# EAGLE design PFC_v1b (EAGLE 7.6.0)
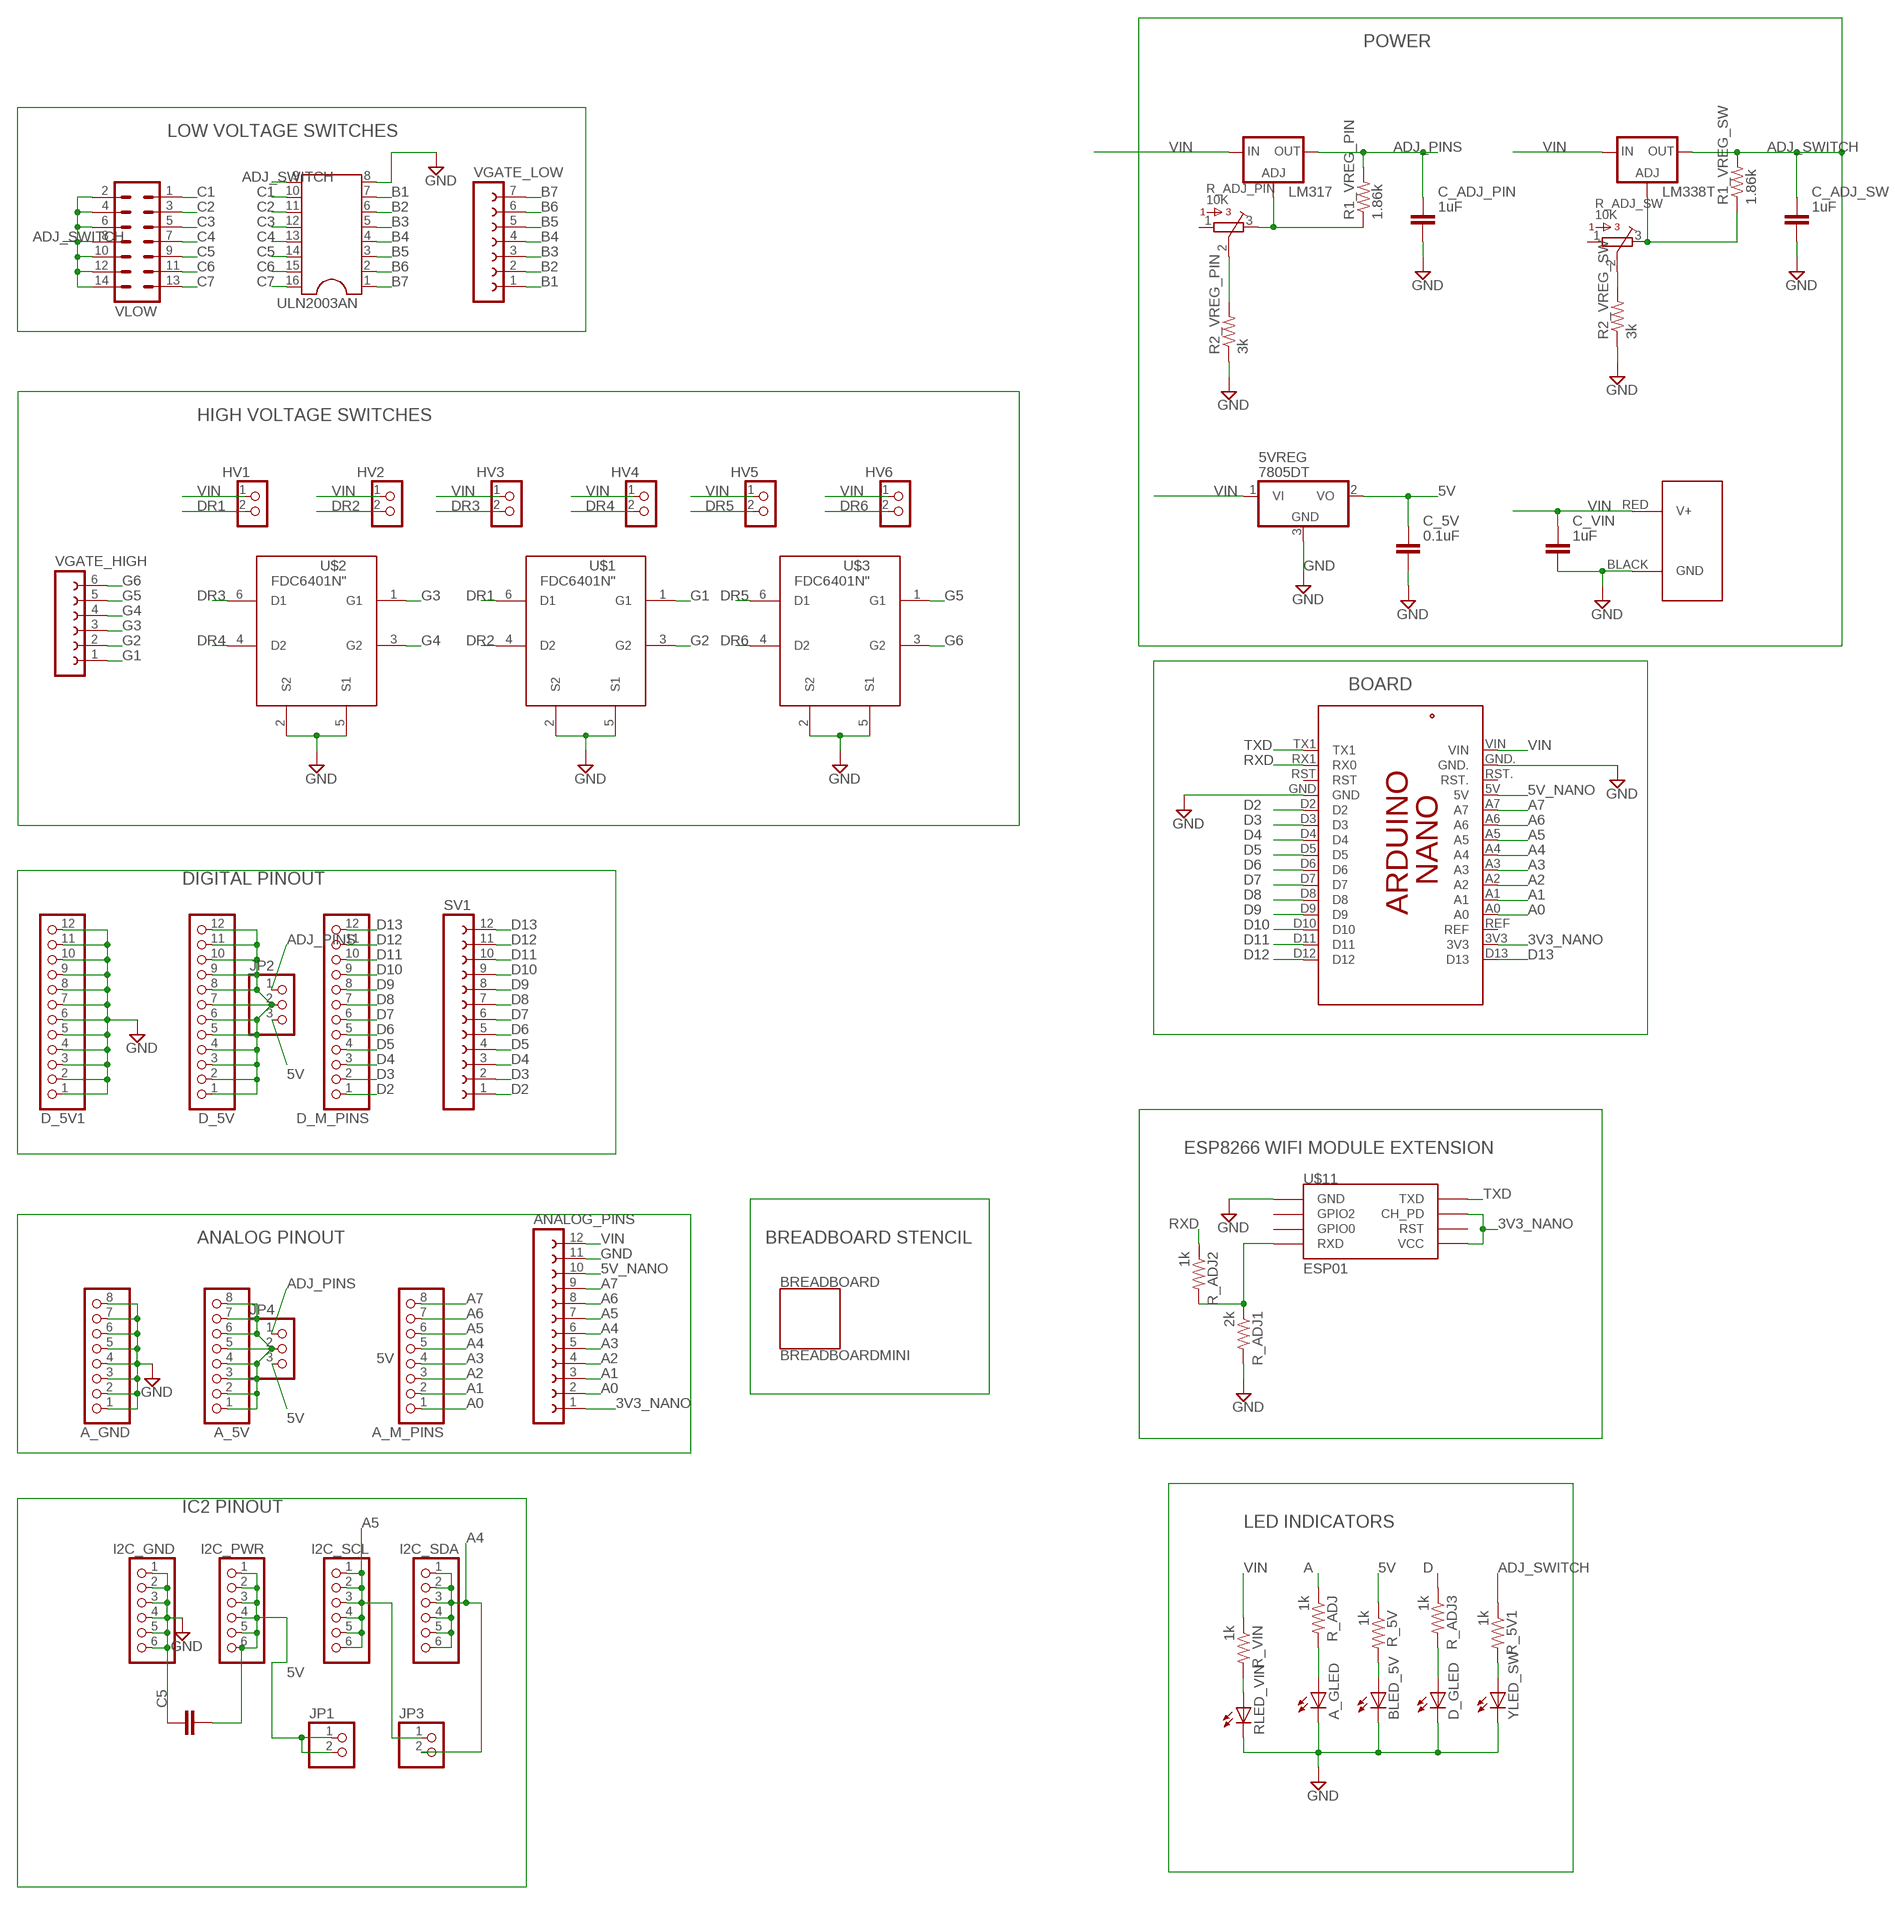
[diagram p0: schematic, sheet 1]

## Parts
5VREG  7805DT  [TO252]
A_5V  PINHD-1X8CLEANBIG  [1X08-CLEANBIG]
A_GLED  LEDCHIP-LED0603  [CHIP-LED0603]
A_GND  PINHD-1X8CLEANBIG  [1X08-CLEANBIG]
A_M_PINS  PINHD-1X8CLEANBIG  [1X08-CLEANBIG]
ANALOG_PINS  FE12-1  [FE12]
BLED_5V  LEDCHIP-LED0603  [CHIP-LED0603]
BREADBOARD  BREADBOARDMINI  [BREADBOARD-MINI]
C5  CAPACITOR_NPOL-0603  [C603]
C_5V  0.1uF  CAPACITOR_NPOL-0603  [C603]
C_ADJ_PIN  1uF  CAPACITOR_NPOL-0603  [C603]
C_ADJ_SW  1uF  CAPACITOR_NPOL-0603  [C603]
C_VIN  1uF  CAPACITOR_NPOL-0603  [C603]
D_5V  PINHD-1X12-CB  [1X12-CB]
D_5V1  PINHD-1X12-CB  [1X12-CB]
D_GLED  LEDCHIP-LED0603  [CHIP-LED0603]
D_M_PINS  PINHD-1X12-CB  [1X12-CB]
HV1  PINHD-2X1  [2X01]
HV2  PINHD-2X1  [2X01]
HV3  PINHD-2X1  [2X01]
HV4  PINHD-2X1  [2X01]
HV5  PINHD-2X1  [2X01]
HV6  PINHD-2X1  [2X01]
I2C_GND  PINHD-1X6CLEAN  [1X06-CLEAN]
I2C_PWR  PINHD-1X6CLEAN  [1X06-CLEAN]
I2C_SCL  PINHD-1X6CLEAN  [1X06-CLEAN]
I2C_SDA  PINHD-1X6CLEAN  [1X06-CLEAN]
J1  POWERPOLE_POWER25A_HORIZONTAL_G2  [POWERPOLE_PAIR_25A_HORIZ_G2]
JP1  HEADER-1X2ROUND  [1X02_ROUND]
JP2  PINHD-1X3CB  [1X03-CLEANBIG]
JP3  HEADER-1X2ROUND  [1X02_ROUND]
JP4  PINHD-1X3CB  [1X03-CLEANBIG]
LM317  LM317TL  [317TL]
LM338T  LM138-TL  [TO220L1]
PCB1  ARDUINO_NANO_SHIELD  [ARDUINO_NANO_SHIELD]
R1_VREG_PIN  1.86k  R-US_R0603  [R0603]
R1_VREG_SW  1.86k  R-US_R0603  [R0603]
R2_VREG_PIN  3k  R-US_R0603  [R0603]
R2_VREG_SW  3k  R-US_R0603  [R0603]
R_5V  1k  R-US_R0603  [R0603]
R_5V1  1k  R-US_R0603  [R0603]
R_ADJ  1k  R-US_R0603  [R0603]
R_ADJ1  2k  R-US_R0603  [R0603]
R_ADJ2  1k  R-US_R0603  [R0603]
R_ADJ3  1k  R-US_R0603  [R0603]
R_ADJ_PIN  10K  3386-P  [3386P]
R_ADJ_SW  10K  3386-P  [3386P]
R_VIN  1k  R-US_R0603  [R0603]
RLED_VIN  LEDCHIP-LED0603  [CHIP-LED0603]
SV1  FE12-1  [FE12]
U$1  FDC6401N"  [SSOT-6]
U$2  FDC6401N"  [SSOT-6]
U$3  FDC6401N"  [SSOT-6]
U$11  ESP01  [ESP01]
ULN2003AN  DIL16S  [SOCKET-16]
VGATE_HIGH  FE06-1  [FE06]
VGATE_LOW  FE07-1  [FE07]
VLOW  MA07-2  [MA07-2]
YLED_SW  LEDCHIP-LED0603  [CHIP-LED0603]

## Nets
3V3_NANO: ANALOG_PINS.1 PCB1.3V3 U$11.CH_PD U$11.VCC
5V: 5VREG.2(VO) C5.2 C_5V.1 I2C_PWR.1 I2C_PWR.2 I2C_PWR.3 I2C_PWR.4 I2C_PWR.5 I2C_PWR.6 JP1.1 JP1.2 JP2.3 JP4.3 R_5V.1
5V_NANO: ANALOG_PINS.10 PCB1.5V
$U: R_ADJ1.1 R_ADJ2.2 U$11.RX(RXD)
A: A_5V.1 A_5V.2 A_5V.3 A_5V.4 A_5V.5 A_5V.6 A_5V.7 A_5V.8 JP4.2 R_ADJ.1
A0: A_M_PINS.1 ANALOG_PINS.2 PCB1.A0
A1: A_M_PINS.2 ANALOG_PINS.3 PCB1.A1
A2: A_M_PINS.3 ANALOG_PINS.4 PCB1.A2
A3: A_M_PINS.4 ANALOG_PINS.5 PCB1.A3
A4: A_M_PINS.5 ANALOG_PINS.6 I2C_SDA.1 I2C_SDA.2 I2C_SDA.3 I2C_SDA.4 I2C_SDA.5 I2C_SDA.6 JP3.2 PCB1.A4
A5: A_M_PINS.6 ANALOG_PINS.7 I2C_SCL.1 I2C_SCL.2 I2C_SCL.3 I2C_SCL.4 I2C_SCL.5 I2C_SCL.6 JP3.1 PCB1.A5
A6: A_M_PINS.7 ANALOG_PINS.8 PCB1.A6
A7: A_M_PINS.8 ANALOG_PINS.9 PCB1.A7
ADJ_PINS: C_ADJ_PIN.1 JP2.1 JP4.1 LM317.2(OUT) R1_VREG_PIN.2
ADJ_SWITCH: C_ADJ_SW.1 LM338T.2(OUT) R1_VREG_SW.2 R_5V1.1 ULN2003AN.9 VLOW.2 VLOW.4 VLOW.6 VLOW.8 VLOW.10 VLOW.12 VLOW.14
B1: ULN2003AN.7 VGATE_LOW.1
B2: ULN2003AN.6 VGATE_LOW.2
B3: ULN2003AN.5 VGATE_LOW.3
B4: ULN2003AN.4 VGATE_LOW.4
B5: ULN2003AN.3 VGATE_LOW.5
B6: ULN2003AN.2 VGATE_LOW.6
B7: ULN2003AN.1 VGATE_LOW.7
C1: ULN2003AN.10 VLOW.1
C2: ULN2003AN.11 VLOW.3
C3: ULN2003AN.12 VLOW.5
C4: ULN2003AN.13 VLOW.7
C5: ULN2003AN.14 VLOW.9
C6: ULN2003AN.15 VLOW.11
C7: ULN2003AN.16 VLOW.13
D: D_5V.1 D_5V.2 D_5V.3 D_5V.4 D_5V.5 D_5V.6 D_5V.7 D_5V.8 D_5V.9 D_5V.10 D_5V.11 D_5V.12 JP2.2 R_ADJ3.1
D2: D_M_PINS.1 PCB1.D2 SV1.1
D3: D_M_PINS.2 PCB1.D3 SV1.2
D4: D_M_PINS.3 PCB1.D4 SV1.3
D5: D_M_PINS.4 PCB1.D5 SV1.4
D6: D_M_PINS.5 PCB1.D6 SV1.5
D7: D_M_PINS.6 PCB1.D7 SV1.6
D8: D_M_PINS.7 PCB1.D8 SV1.7
D9: D_M_PINS.8 PCB1.D9 SV1.8
D10: D_M_PINS.9 PCB1.D10 SV1.9
D11: D_M_PINS.10 PCB1.D11 SV1.10
D12: D_M_PINS.11 PCB1.D12 SV1.11
D13: D_M_PINS.12 PCB1.D13 SV1.12
DR1: HV1.2 U$1.6(D1)
DR2: HV2.2 U$1.4(D2)
DR3: HV3.2 U$2.6(D1)
DR4: HV4.2 U$2.4(D2)
DR5: HV5.2 U$3.6(D1)
DR6: HV6.2 U$3.4(D2)
G1: U$1.1(G1) VGATE_HIGH.1
G2: U$1.3(G2) VGATE_HIGH.2
G3: U$2.1(G1) VGATE_HIGH.3
G4: U$2.3(G2) VGATE_HIGH.4
G5: U$3.1(G1) VGATE_HIGH.5
G6: U$3.3(G2) VGATE_HIGH.6
GND: 5VREG.3(GND) A_GLED.C A_GND.1 A_GND.2 A_GND.3 A_GND.4 A_GND.5 A_GND.6 A_GND.7 A_GND.8 ANALOG_PINS.11 BLED_5V.C C5.1 C_5V.2 C_ADJ_PIN.2 C_ADJ_SW.2 C_VIN.2 D_5V1.1 D_5V1.2 D_5V1.3 D_5V1.4 D_5V1.5 D_5V1.6 D_5V1.7 D_5V1.8 D_5V1.9 D_5V1.10 D_5V1.11 D_5V1.12 D_GLED.C I2C_GND.1 I2C_GND.2 I2C_GND.3 I2C_GND.4 I2C_GND.5 I2C_GND.6 J1.BLACK(GND) PCB1.GND PCB1.GND. R2_VREG_PIN.1 R2_VREG_SW.1 R_ADJ1.2 RLED_VIN.C U$1.2(S2) U$1.5(S1) U$2.2(S2) U$2.5(S1) U$3.2(S2) U$3.5(S1) U$11.GND ULN2003AN.8 YLED_SW.C
N$1: R_VIN.2 RLED_VIN.A
N$2: R2_VREG_SW.2 R_ADJ_SW.2
N$3: A_GLED.A R_ADJ.2
N$4: BLED_5V.A R_5V.2
N$5: LM338T.1(ADJ) R1_VREG_SW.1 R_ADJ_SW.3
N$15: D_GLED.A R_ADJ3.2
N$21: R_5V1.2 YLED_SW.A
N$23: LM317.1(ADJ) R1_VREG_PIN.1 R_ADJ_PIN.3
N$24: R2_VREG_PIN.2 R_ADJ_PIN.2
RXD: PCB1.RX1(RX0) R_ADJ2.1
TXD: PCB1.TX1 U$11.TX(TXD)
VIN: 5VREG.1(VI) ANALOG_PINS.12 C_VIN.1 HV1.1 HV2.1 HV3.1 HV4.1 HV5.1 HV6.1 J1.RED(V+) LM317.3(IN) LM338T.3(IN) PCB1.VIN R_VIN.1
Unconnected: PCB1.REF PCB1.RST PCB1.RST. R_ADJ_PIN.1 R_ADJ_SW.1 U$11.GPIO0 U$11.GPIO2 U$11.RST

## Notes on the sheet
- POWER
- LOW VOLTAGE SWITCHES
- HIGH VOLTAGE SWITCHES
- BOARD
- DIGITAL PINOUT
- ESP8266 WIFI MODULE EXTENSION
- ANALOG PINOUT | BREADBOARD STENCIL
- IC2 PINOUT
- LED INDICATORS

## Library data of the parts
5VREG = adafruit:78*: Positive VOLTAGE REGULATOR Added bigger pads to the TO-92 package
A_5V A_GND A_M_PINS = adafruit:PINHD-1X8: PIN HEADER
A_GLED BLED_5V D_GLED RLED_VIN YLED_SW = led:LED: LED OSRAM: - CHIPLED LG R971, LG N971, LY N971, LG Q971, LY Q971, LO R971, LY R971 LH N974, LH R974 LS Q976, LO Q976, LY Q976 LO Q996 - Hyper CHIPLED LW Q18S LB Q993, LB Q99A, LB R99A - SideLED LS A670, LO A670, LY A670, LG A670, LP A670 LB A673, LV A673, LT A673, LW A673 LH A674 LY A675 LS A676, LA A676, LO A676, LY A676, LW A676 LS A679, LY A679, LG A679 - Hyper Micro SIDELED® LS Y876, LA Y876, LO Y876, LY Y876 LT Y87S - SmartLED LW L88C, LW L88S LB L89C, LB L89S, LG L890 LS L89K, LO L89K, LY L89K LS L896, LA L896, LO L896, LY L896 - TOPLED LS T670, LO T670, LY T670, LG T670, LP T670 LSG T670, LSP T670, LSY T670, LOP T670, LYG T670 LG T671, LOG T671, LSG T671 LB T673, LV T673, LT T673, LW T673 LH T674 LS T676, LA T676, LO T676, LY T676, LB T676, LH T676, LSB T676, LW T676 LB T67C, LV T67C, LT T67C, LS T67K, LO T67K, LY T67K, LW E67C LS E67B, LA E67B, LO E67B, LY E67B, LB E67C, LV E67C, LT E67C LW T67C LS T679, LY T679, LG T679 LS T770, LO T770, LY T770, LG T770, LP T770 LB T773, LV T773, LT T773, LW T773 LH T774 LS E675, LA E675, LY E675, LS T675 LS T776, LA T776, LO T776, LY T776, LB T776 LHGB T686 LT T68C, LB T68C - Hyper Mini TOPLED® LB M676 - Mini TOPLED Santana® LG M470 LS M47K, LO M47K, LY M47K Source: http://www.osram.convergy.de LUXEON: - LUMILED® LXK2-PW12-R00, LXK2-PW12-S00, LXK2-PW14-U00, LXK2-PW14-V00 LXK2-PM12-R00, LXK2-PM12-S00, LXK2-PM14-U00 LXK2-PE12-Q00, LXK2-PE12-R00, LXK2-PE12-S00, LXK2-PE14-T00, LXK2-PE14-U00 LXK2-PB12-K00, LXK2-PB12-L00, LXK2-PB12-M00, LXK2-PB14-N00, LXK2-PB14-P00, LXK2-PB14-Q00 LXK2-PR12-L00, LXK2-PR12-M00, LXK2-PR14-Q00, LXK2-PR14-R00 LXK2-PD12-Q00, LXK2-PD12-R00, LXK2-PD12-S00 LXK2-PH12-R00, LXK2-PH12-S00 LXK2-PL12-P00, LXK2-PL12-Q00, LXK2-PL12-R00 Source: www.luxeon.com KINGBRIGHT: KA-3528ASYC Source: www.kingbright.com
ANALOG_PINS SV1 = con-lsta:FE12-1: FEMALE HEADER; OC_FARNELL: unknown; OC_NEWARK: unknown
BREADBOARD = SparkFun-Boards:BREADBOARD: SparkFun Breadboard Mini This is the mechnical outline for the very small self adhesive breadboard from SparkFun Electronics and our prototyping breadboard of the same size. Good for very small proto areas. SparkFun Products: White <https://www.sparkfun.com/products/7916> Green <https://www.sparkfun.com/products/12046> Black <https://www.sparkfun.com/products/12047> Red <https://www.sparkfun.com/products/12044> Blue <https://www.sparkfun.com/products/12045> SparkFun Solder-able Breadboard-Mini <https://www.sparkfun.com/products/12702>; PROD_ID: COMP-12034
C5 C_5V C_ADJ_PIN C_ADJ_SW C_VIN = dp_devices:CAPACITOR_NPOL: Non-Polarized capacitor in various packages
D_5V D_5V1 D_M_PINS = adafruit:PINHD-1X12: PIN HEADER
HV1-HV6 = pinhead:PINHD-2X1
I2C_GND I2C_PWR I2C_SCL I2C_SDA = adafruit:PINHD-1X6: PIN HEADER
J1 = powerpoles:POWERPOLE_POWER: Anderson Powerpole Power Connector using ameteur radio standard layout
JP1 JP3 = microbuilder:HEADER-1X2: PIN HEADER
JP2 JP4 = adafruit:PINHD-1X3: PIN HEADER
LM317 = v-reg:LM317TL: VOLTAGE REGULATOR
LM338T = v-reg:LM138-TL: VOLTAGE REGULATOR
PCB1 = E14_Arduino_revC:ARDUINO_NANO_SHIELD: Arduino Nano pinout for making a shield
R1_VREG_PIN R1_VREG_SW R2_VREG_PIN R2_VREG_SW R_5V R_5V1 R_ADJ R_ADJ1-R_ADJ3 R_VIN = resistor:R-US_: RESISTOR, American symbol
R_ADJ_PIN R_ADJ_SW = bourns:3386-: 3386 Series 3/8" Square Trimmer
U$1-U$3 = fairchild:FDC6401N: Dual N Channel MOSFET
U$11 = esp8266modules:ESP01: ESP8266 Wifi module 01
ULN2003AN = ic-package:DIL16: Dual In Line / Socket
VGATE_HIGH = con-lsta:FE06-1: FEMALE HEADER; OC_FARNELL: unknown; OC_NEWARK: unknown
VGATE_LOW = con-lsta:FE07-1: FEMALE HEADER; OC_FARNELL: unknown; OC_NEWARK: unknown
VLOW = con-lstb:MA07-2: PIN HEADER; OC_FARNELL: unknown; OC_NEWARK: unknown

## Board
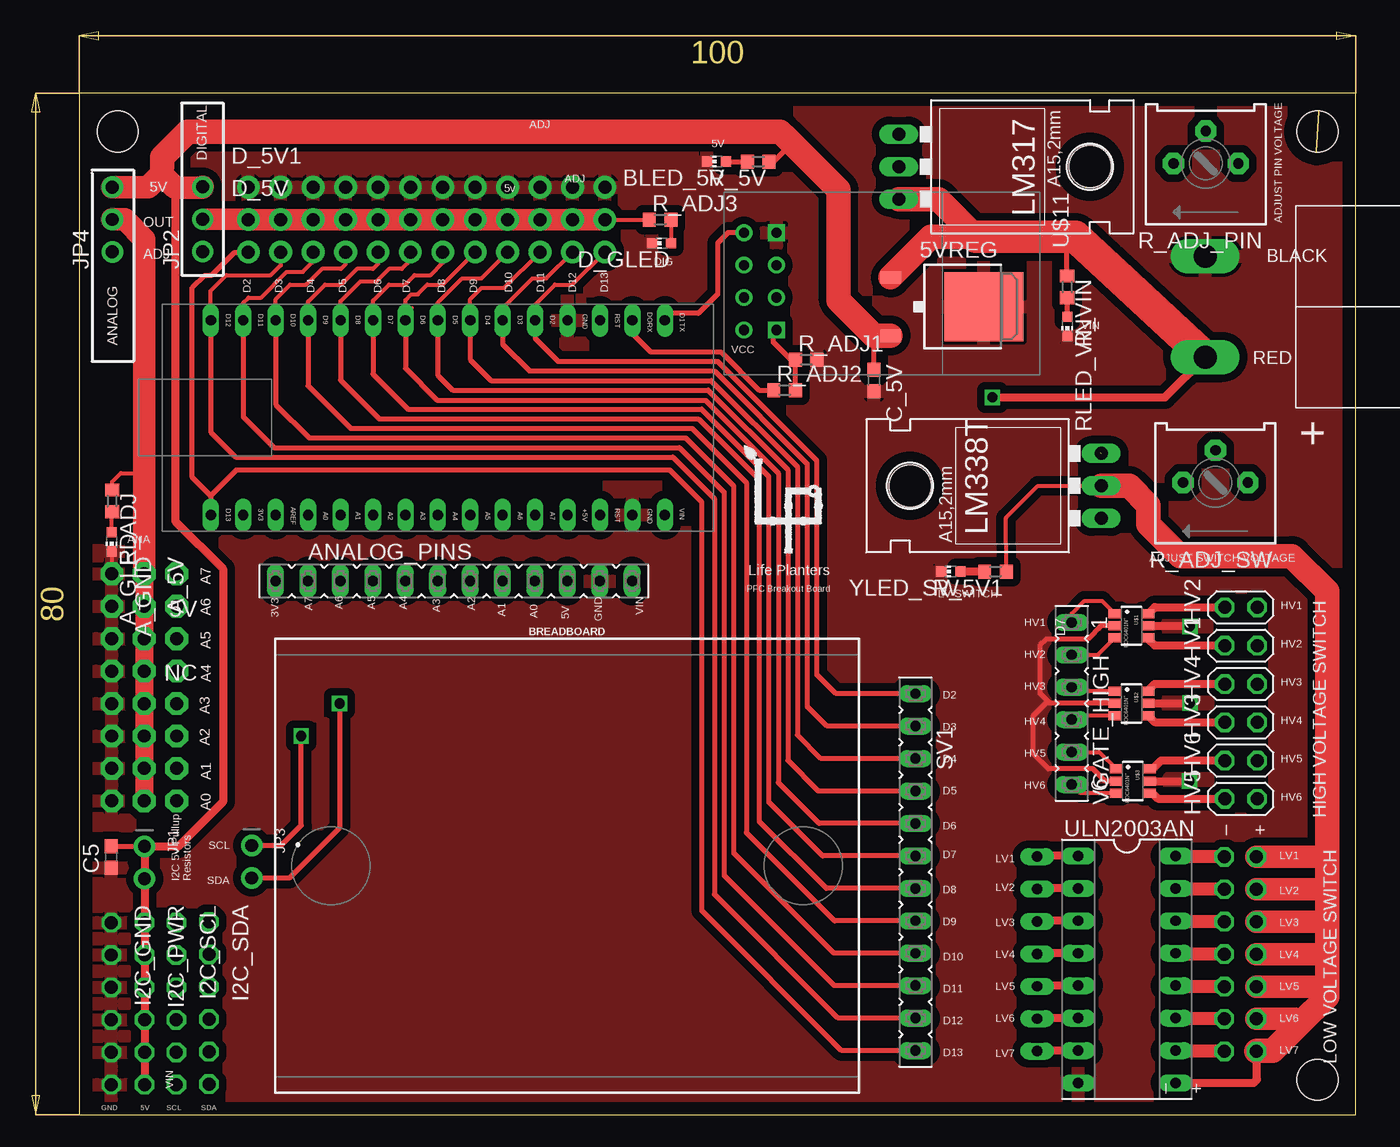
[diagram p1: board, top side]
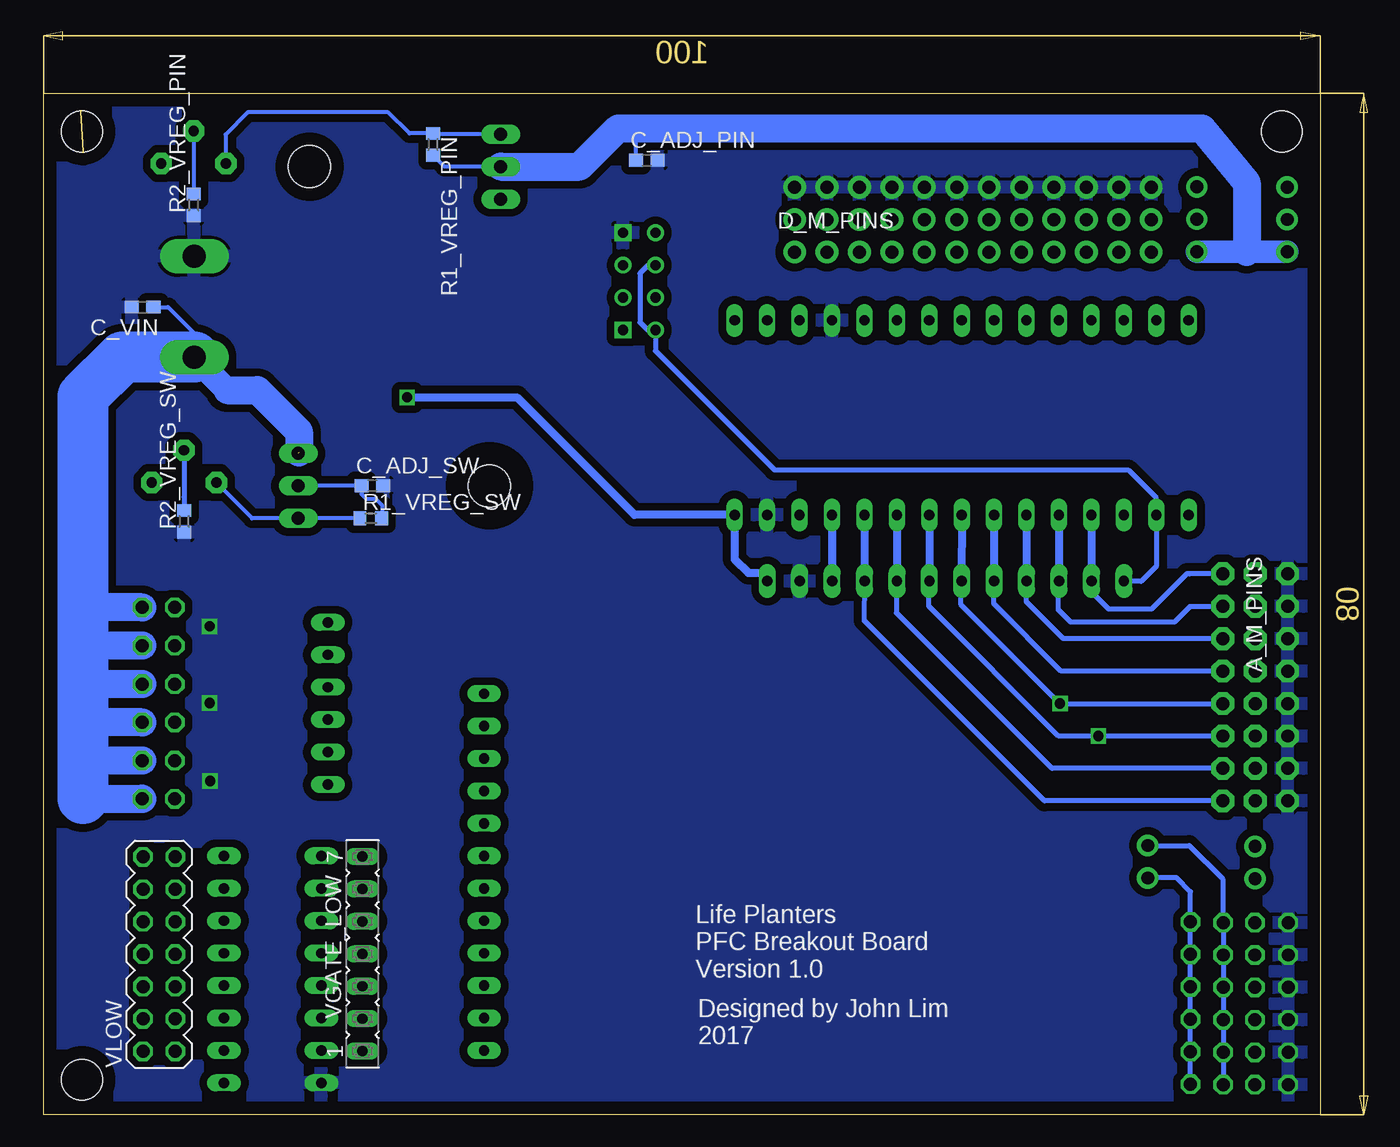
[diagram p2: board, bottom side, seen from below]

Size 100 x 80 mm. Coordinates in mm from the lower left corner, seen from the top.
Outline: 0,0 100,0 100,80 0,80 0,0
Copper layers (1*16): Top 0.035mm / dielectric 1.5mm / Bottom 0.035mm
Design rules "default": minimum track width 10mil, minimum drill 24mil, track to track 8mil, track to pad 8mil, pad to pad 8mil, via to via 8mil, smd to smd 8mil, copper to edge 40mil, drill to drill 8mil, minimum pad ring 10mil, minimum via ring 8mil, stop-mask expansion 4mil, vias tented up to drill 0mil, thermal gap 10mil
Holes 3.2 mm at 97,77 97,2.75 3,77

### Footprints (pad centres in the part's own frame; a part is rotated, then mirrored left to right if it is on the bottom)
TO252 = smd 1 x 1.6: 1 -2.28,-4.8; 2 2.28,-4.8 | smd 5.4 x 6.2: 3 0,2.5
1X08-CLEANBIG = drill 1.016 pad 1.778 octagon: 1 -8.89,0; 2 -6.35,0; 3 -3.81,0; 4 -1.27,0; 5 1.27,0; 6 3.81,0; 7 6.35,0; 8 8.89,0
CHIP-LED0603 = smd 0.8 x 0.8: A 0,-0.75; C 0,0.75
FE12 = drill 0.813 long: 1 -13.97,0; 2 -11.43,0; 3 -8.89,0; 4 -6.35,0; 5 -3.81,0; 6 -1.27,0; 7 1.27,0; 8 3.81,0; 9 6.35,0; 10 8.89,0; 11 11.43,0; 12 13.97,0
C603 = smd 1.1 x 1: 1 -0.85,0; 2 0.85,0
1X12-CB = drill 1.016 pad 1.778: 1 -13.97,0; 2 -11.43,0; 3 -8.89,0; 4 -6.35,0; 5 -3.81,0; 6 -1.27,0; 7 1.27,0; 8 3.81,0; 9 6.35,0; 10 8.89,0; 11 11.43,0; 12 13.97,0
2X01 = drill 1.016 octagon: 1 -1.27,-1.27; 2 -1.27,1.27
1X06-CLEAN = drill 1.016 octagon: 1 -6.35,0; 2 -3.81,0; 3 -1.27,0; 4 1.27,0; 5 3.81,0; 6 6.35,0
POWERPOLE_PAIR_25A_HORIZ_G2 = drill 1.8 long: BLACK -3.95,-7.1; RED 3.95,-7.1
1X02_ROUND = drill 1 pad 1.676: 1 -1.27,0; 2 1.27,0
1X03-CLEANBIG = drill 1.016 pad 1.676: 1 -2.54,0; 2 0,0; 3 2.54,0
317TL = drill 1.016 long: 1 -2.54,-3.81; 2 0,-3.81; 3 2.54,-3.81 | hole 3.302: 0,11.176
TO220L1 = drill 1.016 long: 1 -2.54,-3.81; 2 0,-3.81; 3 2.54,-3.81 | hole 3.302: 0,11.176
ARDUINO_NANO_SHIELD = drill 0.8 long: 3V3 -13.97,-7.62; 5V 11.43,-7.62; A0 -8.89,-7.62; A1 -6.35,-7.62; A2 -3.81,-7.62; A3 -1.27,-7.62; A4 1.27,-7.62; A5 3.81,-7.62; A6 6.35,-7.62; A7 8.89,-7.62; D2 8.89,7.62; D3 6.35,7.62; D4 3.81,7.62; D5 1.27,7.62; D6 -1.27,7.62; D7 -3.81,7.62; D8 -6.35,7.62; D9 -8.89,7.62; D10 -11.43,7.62; D11 -13.97,7.62; D12 -16.51,7.62; D13 -16.51,-7.62; GND 11.43,7.62; GND. 16.51,-7.62; REF -11.43,-7.62; RST 13.97,7.62; RST. 13.97,-7.62; RX1 16.51,7.62; TX1 19.05,7.62; VIN 19.05,-7.62
R0603 = smd 1 x 1.1: 1 -0.85,0; 2 0.85,0
3386P = drill 0.813 pad 1.676 octagon: 1 -2.54,0; 2 0,-2.54; 3 2.54,0
SSOT-6 = smd 0.7 x 1: 1 -0.95,-1.3; 2 0,-1.3; 3 0.95,-1.3; 4 -0.95,1.3; 5 0,1.3; 6 0.95,1.3
ESP01 = drill 0.8: CH_PD -1.285,-8.178; GPIO0 1.255,-5.638; GPIO2 -1.285,-5.638; RST 1.255,-8.178; TX -3.825,-8.178; VCC 3.795,-8.178 | drill 0.8 square: GND -3.825,-5.638; RX 3.795,-5.638
SOCKET-16 = drill 0.813 long: 1 -8.89,-3.81; 2 -6.35,-3.81; 3 -3.81,-3.81; 4 -1.27,-3.81; 5 1.27,-3.81; 6 3.81,-3.81; 7 6.35,-3.81; 8 8.89,-3.81; 9 8.89,3.81; 10 6.35,3.81; 11 3.81,3.81; 12 1.27,3.81; 13 -1.27,3.81; 14 -3.81,3.81; 15 -6.35,3.81; 16 -8.89,3.81
FE06 = drill 0.813 long: 1 -6.35,0; 2 -3.81,0; 3 -1.27,0; 4 1.27,0; 5 3.81,0; 6 6.35,0
FE07 = drill 0.813 long: 1 -7.62,0; 2 -5.08,0; 3 -2.54,0; 4 0,0; 5 2.54,0; 6 5.08,0; 7 7.62,0
MA07-2 = drill 1.016 octagon: 1 -7.62,-1.27; 2 -7.62,1.27; 3 -5.08,-1.27; 4 -5.08,1.27; 5 -2.54,-1.27; 6 -2.54,1.27; 7 0,-1.27; 8 0,1.27; 9 2.54,-1.27; 10 2.54,1.27; 11 5.08,-1.27; 12 5.08,1.27; 13 7.62,-1.27; 14 7.62,1.27

### Placement (x,y rotation side)
5VREG  68.35,63.29 270 top
A_5V  5.08,33.47 270 top
A_GLED  2.53,44.86 180 top
A_GND  2.54,33.47 270 top
A_M_PINS  7.62,33.47 270 bottom
ANALOG_PINS  29.34,41.79 0 top
BLED_5V  49.91,74.65 90 top
BREADBOARD  38.2,19.5 0 top
C5  2.5,20.19 90 top
C_5V  62.25,57.5 270 top
C_ADJ_PIN  52.75,74.75 0 bottom
C_ADJ_SW  74.25,49.25 0 bottom
C_VIN  92.25,63.25 180 bottom
D_5V  27.2,70.1 0 top
D_5V1  27.2,72.64 0 top
D_GLED  45.61,68.25 90 top
D_M_PINS  27.2,67.56 0 bottom
HV1  91,38 90 top
HV2  91,41 90 top
HV3  91,32 90 top
HV4  91,35 90 top
HV5  91,26 90 top
HV6  91,29 90 top
I2C_GND  2.5,8.7 270 top
I2C_PWR  5.1,8.7 270 top
I2C_SCL  7.6,8.7 270 top
I2C_SDA  10.15,8.75 270 top
J1  95.29,63.28 270 top
JP1  5.1,19.75 270 top
JP2  9.66,70.13 90 top
JP3  13.5,19.81 270 top
JP4  2.58,70.11 90 top
LM317  68,74.25 270 top
LM338T  76.25,49.25 90 top
PCB1  26.81,54.59 0 top
R1_VREG_PIN  69.5,76 270 bottom
R1_VREG_SW  74.37,46.71 0 bottom
R2_VREG_PIN  88.25,71.25 90 bottom
R2_VREG_SW  88.99,46.47 90 bottom
R_5V  53.18,74.64 180 top
R_5V1  71.77,42.54 180 top
R_ADJ  2.56,48.07 270 top
R_ADJ1  56.94,59.12 0 top
R_ADJ2  55.25,56.75 0 top
R_ADJ3  45.5,70.1 0 top
R_ADJ_PIN  88.25,74.5 180 top
R_ADJ_SW  89,49.5 180 top
R_VIN  77.38,64.83 270 top
RLED_VIN  77.4,61.74 180 top
SV1  65.5,19 270 top
U$1  82.42,38.29 270 top
U$2  82.42,32.21 270 top
U$3  82.52,26.13 270 top
U$11  60.25,65.25 270 top
ULN2003AN  82.06,11.38 270 top
VGATE_HIGH  77.74,32.21 270 top
VGATE_LOW  75.02,12.6 90 bottom
VLOW  90.95,12.58 90 bottom
YLED_SW  68.27,42.54 90 top

### Tracks (layer width: path | path; a pad name or v marks a point on that pad's centre or on a via)
3V3_NANO
  Bottom 0.406: ANALOG_PINS.1 15.35,41.77 14.01,41.77 12.84,42.94 PCB1.3V3 12.84,48.31 15.03,50.5 42.75,50.5 52.07,59.82 U$11.VCC 52.08,61.46 52.7,61.46 53.29,62.06 53.29,65.88 52.64,66.53 U$11.CH_PD
5V
  Top 0.406: C5.2 5.08,21.04 JP1.1 | R_5V.1 54.39,74.64 56,76.25 55.65,76.25 55.39,76.51 | C_5V.1 62.25,60.75 62.51,61.01
  Top 0.61: 7.51,72.61 7.51,46.49 11.25,42.75 11.25,24.5 7.77,21.02 JP1.1 JP1.2 I2C_PWR.1 I2C_PWR.2 I2C_PWR.3 I2C_PWR.4 I2C_PWR.5 I2C_PWR.6
  Top 1.778: 6.5,74.25 6.5,73.75 | 6.5,73.75 6.5,73.62 7.51,72.61 9.6,72.61 JP2.3 | JP4.3 5.4,72.65 6.5,73.75
  Top 1.93: 6.5,74.25 6.5,75 8.5,77 54.9,77 55.39,76.51 59.48,72.42 59.48,63.8 62.27,61.01 62.51,61.01 5VREG.2
5V_NANO
  Bottom 0.61: PCB1.5V 38.25,41.81 ANALOG_PINS.10
$U
  Top 0.406: U$11.RX 54.37,61.45 54.37,60.48 55.73,59.12 R_ADJ1.1 R_ADJ2.2
A
  Top 0.305: R_ADJ.1 2.56,49.56 3.25,50.25 5.08,50.25
  Top 1.422: A_5V.1 A_5V.2 A_5V.3 A_5V.4 A_5V.5 A_5V.6 A_5V.7 A_5V.8
  Top 1.778: JP4.2 3.54,70.11 5.08,68.57 5.08,50.25 A_5V.1
A0
  Bottom 0.406: ANALOG_PINS.2 17.96,41.78 17.96,41.01 16.55,39.59 14.26,39.59 13.21,39.59 10.42,42.38 10.24,42.38 10.22,42.36 A_M_PINS.1
  Bottom 0.61: PCB1.A0 17.93,41.81 ANALOG_PINS.2
A1
  Bottom 0.406: ANALOG_PINS.3 20.51,41.77 20.51,39.55 19.54,38.57 11.41,38.57 10.18,39.81 7.63,39.81 A_M_PINS.2
  Bottom 0.61: PCB1.A1 20.46,41.8 ANALOG_PINS.3
A2
  Bottom 0.406: A_M_PINS.3 20.12,37.28 23.02,40.18 23.02,41.78 ANALOG_PINS.4
  Bottom 0.61: 23.01,41.81 ANALOG_PINS.4 23,41.8 PCB1.A2
A3
  Bottom 0.406: A_M_PINS.4 20.29,34.74 25.57,40.02 ANALOG_PINS.5
  Bottom 0.61: PCB1.A3 25.54,41.8 ANALOG_PINS.5
A4  (via drill 0.8)
  Top 0.406: JP3.2 16.47,18.54 20.38,22.46 v20.38,32.2
  Bottom 0.406: ANALOG_PINS.6 28.13,41.77 28.13,39.95 v20.38,32.2 A_M_PINS.5 | JP3.2 11.22,18.54 10.15,17.47 I2C_SDA.1 I2C_SDA.2 I2C_SDA.3 I2C_SDA.4 I2C_SDA.5 I2C_SDA.6
  Bottom 0.61: PCB1.A4 28.09,41.81 ANALOG_PINS.6
A5  (via drill 0.8)
  Top 0.406: JP3.1 13.52,21.06 15.78,21.06 17.37,22.66 v17.37,29.66
  Bottom 0.406: ANALOG_PINS.7 30.66,41.78 30.66,39.83 20.49,29.66 v17.37,29.66 A_M_PINS.6 | JP3.1 10.25,21.08 7.6,18.43 I2C_SCL.1 I2C_SCL.2 I2C_SCL.3 I2C_SCL.4 I2C_SCL.5 I2C_SCL.6
  Bottom 0.61: PCB1.A5 30.62,41.8 ANALOG_PINS.7
A6
  Bottom 0.406: A_M_PINS.7 21,27.12 33.19,39.31 ANALOG_PINS.8
  Bottom 0.61: PCB1.A6 33.17,41.81 ANALOG_PINS.8
A7
  Bottom 0.406: A_M_PINS.8 21.59,24.58 35.73,38.72 ANALOG_PINS.9
  Bottom 0.61: PCB1.A7 35.7,41.8 ANALOG_PINS.9
ADJ_PINS
  Bottom 0.305: LM317.2 68.6,74.25 R1_VREG_PIN.2 | C_ADJ_PIN.1 53.6,76.85 54,77.25
  Bottom 1.778: 5.75,67.58 JP2.1 | JP4.1 5.57,67.57 5.75,67.75
  Bottom 2.184: LM317.2 58,74.25 55,77.25 54,77.25 9.25,77.25 5.75,73 5.75,67.75 5.75,67.58
ADJ_SWITCH
  Top 0.305: R_5V1.1 72.6,46.75 C_ADJ_SW.1 LM338T.2
  Top 0.61: ULN2003AN.9 91.99,2.49 92.25,2.75 92.25,4.93 VLOW.2
  Top 1.778: VLOW.14 97.3,20.2 97.75,19.75 | VLOW.12 97.59,17.66 97.75,17.5 | VLOW.10 97.62,15.12 97.75,15.25 | VLOW.8 97.42,12.58 97.75,12.25 | VLOW.6 97.71,10.04 97.75,10 | VLOW.4 95.25,7.5 95.62,7.12
  Top 1.93: VLOW.2 92.26,5 93.5,5 95.62,7.12 97.75,9.25 97.75,10 97.75,12.25 97.75,15.25 97.75,17.5 97.75,19.75 97.75,41 95,43.75 86.25,43.75 83.75,46.25 83.75,47.75 82.25,49.25 LM338T.2
  Bottom 0.305: LM338T.2 C_ADJ_SW.1 75.1,48.6 74.75,48.25 74,48.25 73.5,47.75 73.5,46.73 R1_VREG_SW.2 73.5,46.85
B1
  Top 0.61: ULN2003AN.7 75.07,5.03 VGATE_LOW.1
B2
  Top 0.61: ULN2003AN.6 75.07,7.57 VGATE_LOW.2
B3
  Top 0.61: ULN2003AN.5 75.07,10.11 VGATE_LOW.3
B4
  Top 0.61: ULN2003AN.4 75.07,12.65 VGATE_LOW.4
B5
  Top 0.61: ULN2003AN.3 75.07,15.19 VGATE_LOW.5
B6
  Top 0.61: ULN2003AN.2 75.07,17.73 VGATE_LOW.6
B7
  Top 0.61: ULN2003AN.1 75.07,20.27 VGATE_LOW.7
C1
  Top 1.016: VLOW.1 85.94,4.96 ULN2003AN.10
C2
  Top 1.016: VLOW.3 85.94,7.5 ULN2003AN.11
C3
  Top 1.016: VLOW.5 85.94,10.04 ULN2003AN.12
C4
  Top 1.016: VLOW.7 85.94,12.58 ULN2003AN.13
C5
  Top 1.016: VLOW.9 85.94,15.12 ULN2003AN.14
C6
  Top 1.016: VLOW.11 85.94,17.66 ULN2003AN.15
C7
  Top 1.016: VLOW.13 85.94,20.2 ULN2003AN.16
D
  Top 0.305: D_5V.12 R_ADJ3.1
  Top 1.676: JP2.2 13.2,70.13 D_5V.1 D_5V.2 D_5V.3 D_5V.4 D_5V.5 D_5V.6 D_5V.7 D_5V.8 D_5V.9 D_5V.10 D_5V.11 D_5V.12
D2
  Top 0.305: PCB1.D2 35.7,63.45 37.25,65 38.61,65 D_M_PINS.1
  Top 0.406: PCB1.D2 35.7,60.8 37.5,59 50,59 57.75,51.25 57.75,34.5 59.28,32.97 SV1.1
D3
  Top 0.305: PCB1.D3 33.16,63.16 35.5,65.5 36.57,65.5 D_M_PINS.2
  Top 0.406: PCB1.D3 33.16,60.34 35.25,58.25 49.75,58.25 57,51 57,32 58.57,30.43 SV1.2
D4
  Top 0.305: PCB1.D4 30.62,63.87 31.5,64.75 33.28,64.75 D_M_PINS.3
  Top 0.406: PCB1.D4 30.62,59.13 32.25,57.5 49.5,57.5 56.25,50.75 56.25,29.75 58.11,27.89 SV1.3
D5
  Top 0.305: PCB1.D5 28.08,63.58 30,65.5 31.49,65.5 D_M_PINS.4
  Top 0.406: PCB1.D5 28.08,57.92 29.25,56.75 49.25,56.75 55.5,50.5 55.5,27.75 57.9,25.35 SV1.4
D6
  Top 0.305: 26.04,63.16 PCB1.D6 25.54,63.79 26,64.25 26.5,64.25 27.25,65 28.45,65 D_M_PINS.5
  Top 0.406: PCB1.D6 25.54,58.46 28,56 28.01,56 28.07,55.94 49.06,55.94 54.75,50.25 54.75,26 57.94,22.81 SV1.5
D7
  Top 0.305: PCB1.D7 23,63.75 24.25,65 25.5,65 26.25,65.75 27.5,65.75 28.5,66.75 28.5,67.53 D_M_PINS.6
  Top 0.406: PCB1.D7 23,58 25.75,55.25 48.75,55.25 54,50 54,24.5 58.23,20.27 SV1.6
D8
  Top 0.305: PCB1.D8 20.46,63.71 22,65.25 23.25,65.25 24.25,66.25 25.25,66.25 25.93,66.93 D_M_PINS.7
  Top 0.406: PCB1.D8 20.46,57.54 23.5,54.5 48.5,54.5 53.25,49.75 53.25,23 58.52,17.73 SV1.7
D9
  Top 0.305: PCB1.D9 17.92,63.67 19.25,65 20.5,65 21.75,66.25 23,66.25 23.39,66.64 D_M_PINS.8
  Top 0.406: PCB1.D9 17.92,57.08 21.25,53.75 48,53.75 52.25,49.5 52.25,22.1 59.16,15.19 SV1.8
D10
  Top 0.305: PCB1.D10 15.38,63.88 16.5,65 17.75,65 19,66.25 20.5,66.25 20.85,66.6 D_M_PINS.9
  Top 0.406: PCB1.D10 15.38,55.62 18,53 47.5,53 51.25,49.25 51.25,20.5 59.1,12.65 SV1.9
D11
  Top 0.305: PCB1.D11 12.84,63.59 13.25,64 14.25,64 16.25,66 17.5,66 18.25,66.75 18.25,67.5 D_M_PINS.10
  Top 0.406: PCB1.D11 12.84,54.66 15.25,52.25 47,52.25 50.5,48.75 50.5,18.75 59.14,10.11 SV1.10
D12
  Top 0.305: D_M_PINS.11 15.77,66.52 15,65.75 11.5,65.75 10.25,64.5 10.25,62.26 PCB1.D12
  Top 0.406: PCB1.D12 10.3,53.45 12.25,51.5 46.5,51.5 49.75,48.25 49.75,17.25 59.43,7.57 SV1.11
D13
  Top 0.406: SV1.12 59.72,5.03 48.75,16 48.75,48 46.25,50.5 12.31,50.5 10.29,48.48 | 10.29,48.48 10.29,46.98 PCB1.D13 | 10.29,48.48 8.85,49.91 8.85,64.78 9.8,65.73 10.35,65.73 12.16,67.54 12.56,67.54 12.57,67.56 D_M_PINS.12
DR1
  Top 0.61: U$1.6 83.72,37.28 84.25,36.75 89.71,36.75 HV1.2
DR2
  Top 0.61: U$1.4 83.74,39.24 84.25,39.75 89.71,39.75 HV2.2
DR3
  Top 0.61: U$2.6 83.74,31.26 84.25,30.75 89.71,30.75 HV3.2
DR4
  Top 0.61: U$2.4 83.72,33.22 84.25,33.75 89.71,33.75 HV4.2
DR5
  Top 0.61: U$3.6 84.07,25.18 84.5,24.75 89.71,24.75 HV5.2
DR6
  Top 0.61: U$3.4 84.08,27.08 84.75,27.75 89.71,27.75 HV6.2
G1
  Top 0.305: VGATE_HIGH.1 77.74,39.24 78.75,40.25 80.11,40.25 U$1.1
G2
  Top 0.305: VGATE_HIGH.2 79.8,36.02 U$1.3
G3
  Top 0.305: U$2.1 78.06,33.16 VGATE_HIGH.3
G4
  Top 0.305: U$2.3 78.06,31.26 VGATE_HIGH.4
G5
  Top 0.305: VGATE_HIGH.5 79.9,28.4 U$3.1
G6
  Top 0.305: U$3.3 78.42,25.18 VGATE_HIGH.6
GND  (via drill 0.8)
  Top 0.305: A_GLED.C A_GND.1
  Top 0.406: U$1.2 80.04,38.29 79,37.25 75.75,37.25 75.25,36.75 75.25,33 75.88,32.38 | 75.88,32.38 76,32.25 81.08,32.25 U$2.2 | U$3.2 80.37,26.13 79.41,27.09 75.91,27.09 74.75,28.25 74.75,31.25 75.88,32.38
  Top 0.61: U$2.5 86.96,32.21 v87,32.25 | U$3.5 v86.96,26.13 | U$1.5 86.96,38.29 v87,38.25
  Bottom 0.61: 86.96,32.21 v87,32.25
  pour Top (isolate 0.61): 0.65,0.6 99.35,0.6 99.4,79.35 0.8,79.45
  pour Bottom (isolate 0.61): 0.75,78.75 0.75,0.75 99,0.75 98.75,3.25 99,78.75
N$1
  Top 0.406: R_VIN.2 77.38,62.51 RLED_VIN.A
N$2
  Bottom 0.406: R_ADJ_SW.2 88.99,52.03 88.99,48.4 R2_VREG_SW.2
N$3
  Top 0.305: A_GLED.A 2.53,47.19 R_ADJ.2
N$4
  Top 0.406: BLED_5V.A R_5V.2
N$5
  Bottom 0.305: R1_VREG_SW.1 LM338T.1 83.67,46.71 R_ADJ_SW.3
N$15
  Top 0.305: R_ADJ3.2 D_GLED.A
N$21
  Top 0.61: R_5V1.2 YLED_SW.A
N$23
  Bottom 0.305: LM317.1 69.44,76.79 R1_VREG_PIN.1 71.35,76.85 73,78.5 84,78.5 85.75,76.75 85.75,74.54 R_ADJ_PIN.3
N$24
  Bottom 0.305: R_ADJ_PIN.2 R2_VREG_PIN.2
RXD
  Top 0.406: R_ADJ2.1 53.25,56.75 50.25,59.75 44.75,59.75 43.32,61.18 PCB1.RX1
TXD
  Top 0.406: U$11.TX 50.83,69.08 50,68.25 50,64.25 48.5,62.75 46.4,62.75 PCB1.TX1
VIN  (via drill 0.8)  (1 unrouted)
  Top 0.406: R_VIN.1 77.38,68.13 77.5,68.25 78.26,68.25 78.4,68.39
  Top 0.61: v71.53,56.18 85.04,56.18 J1.RED
  Top 1.778: 63.6,65.62 5VREG.1
  Top 1.93: LM317.3 67.29,71.71 70.25,68.75 66.73,68.75 5VREG.1
  Top 2.54: 70.25,68.75 78.02,68.75 78.4,68.39 J1.RED
  Bottom 0.305: C_VIN.1 90.25,63.25 88.25,61.25 88.25,59.39 J1.RED
  Bottom 0.61: v71.53,56.18 62.93,56.18 53.72,46.97 PCB1.VIN 45.86,43.5 44.79,42.43 43.33,42.43 ANALOG_PINS.12
  Bottom 1.93: 85.61,56.75 J1.RED
  Bottom 2.184: 96.92,24.75 92.29,24.75 HV5.1 | HV6.1 96.69,27.73 96.92,27.5 | HV3.1 96.9,30.73 96.92,30.75 | HV4.1 96.9,33.73 96.92,33.75 | HV1.1 96.65,36.73 96.92,37 | HV2.1 96.4,39.73 96.92,40.25 | 85.61,56.75 83.25,56.75 80,53.5 80,51.85
  Bottom 4: 96.92,24.75 96.92,27.5 96.92,30.75 96.92,33.75 96.92,37 96.92,40.25 96.92,56.25 93.84,59.33 J1.RED

### Text on the board
tPlace: VCC | /Users/johnlimjsj/Desktop/lp_bitm.bmp
bPlace: Life Planters / PFC Breakout Board / Version 1.0 | Designed by John Lim / 2017
tSilk: 5V | DIGITAL | 5V | OUT | ADJUST PIN VOLTAGE | ADJ | BLACK | D10 | D11 | D12 | D13 | DIG | D2 | D3 | D4 | D5 | D6 | D7 | D8 | D9 | VIN | ANALOG | RED | ANA | A7 | ADJUST SWITCH VOLTAGE | Life Planters | PFC Breakout Board | 5V | A6 | A7 | A6 | A5 | A4 | A2 | LV SWITCH | HV1 | HIGH VOLTAGE SWITCH | 3V3 | A3 | A1 | A0 | 5V | GND | VIN | A5 | HV1 | D7 | HV2 | HV2 | NC | A4 | HV3 | A3 | D2 | HV3 | D3 | HV4 | A2 | HV4 | A1 | D4 | HV5 | HV5 | D5 | HV6 | A0 | HV6 | D6 | – | + | SCL | D7 | LOW VOLTAGE SWITCH | LV1 | LV1 | SDA | D8 | LV2 | LV2 | D9 | LV3 | LV3 | D10 | LV4 | LV4 | D11 | LV5 | LV5 | D12 | LV6 | LV6 | D13 | LV7 | LV7 | – | + | GND | 5V | SCL | SDA
_tsilk: ADJ | ADJ | 5v | I2C 5V Pullup / Resistors | VIN